# Altium schematic sheet Sheet_1_2022-01-15.schdoc
size 300 x 125 mm
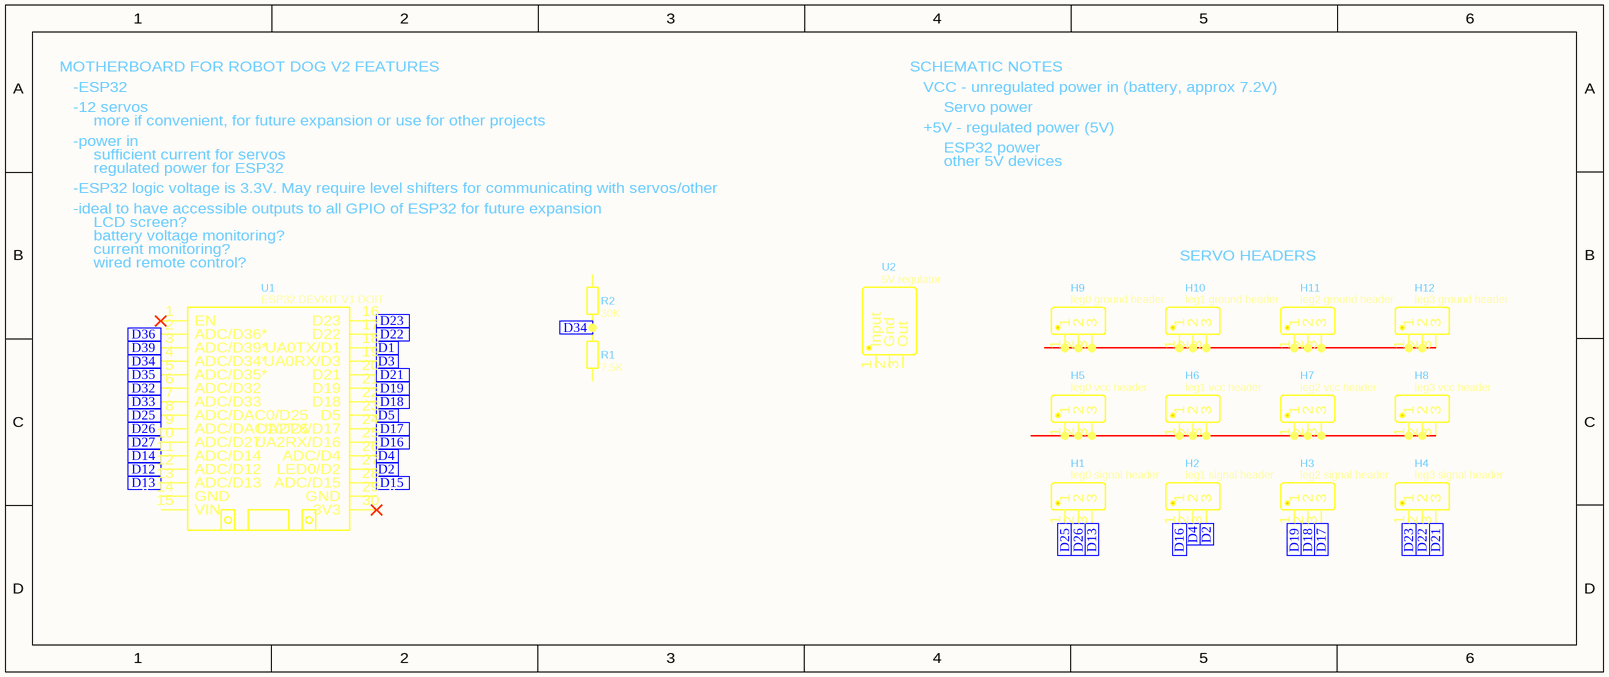
[diagram p0: Sheet_1_2022-01-15.schdoc]

## Parts
H1  leg0 signal header  [HDR-TH_3P-P2.54-V-M]
H2  leg1 signal header  [HDR-TH_3P-P2.54-V-M]
H3  leg2 signal header  [HDR-TH_3P-P2.54-V-M]
H4  leg3 signal header  [HDR-TH_3P-P2.54-V-M]
H5  leg0 vcc header  [HDR-TH_3P-P2.54-V-M]
H6  leg1 vcc header  [HDR-TH_3P-P2.54-V-M]
H7  leg2 vcc header  [HDR-TH_3P-P2.54-V-M]
H8  leg3 vcc header  [HDR-TH_3P-P2.54-V-M]
H9  leg0 ground header  [HDR-TH_3P-P2.54-V-M]
H10  leg1 ground header  [HDR-TH_3P-P2.54-V-M]
H11  leg2 ground header  [HDR-TH_3P-P2.54-V-M]
H12  leg3 ground header  [HDR-TH_3P-P2.54-V-M]
R1  7.5K  [RES-TH_BD2.5-L6.5-P10.50-D0.6]
R2  30K  [RES-TH_BD2.2-L6.5-P10.50-D0.6]
U1  ESP32 DEVKIT V1 DOIT  [DOIT-ESP32-DEVKIT-V1]
U2  5V regulator  [TO-220-3_L10.0-W4.5-P2.54-L]

## Blocks framed on the sheet
SERVO HEADERS: H1-H12

## Ports
D1 (in), D2 (in), D3 (in), D4 (in), D5 (in), D12 (in), D13 (in), D14 (in), D15 (in), D16 (in), D17 (in), D18 (in), D19 (in), D21 (in), D22 (in), D23 (in), D25 (in), D26 (in), D27 (in), D32 (in), D33 (in), D34 (in), D35 (in), D36 (in), D39 (in)

## Nets
+5V: U1.15(VIN) U2.3(Out)
GND: H9.1 H9.2 H9.3 H10.1 H10.2 H10.3 H11.1 H11.2 H11.3 H12.1 H12.2 H12.3 R1.1 U1.14(GND) U1.29(GND) U2.2(Gnd)
VCC: H5.1 H5.2 H5.3 H6.1 H6.2 H6.3 H7.1 H7.2 H7.3 H8.1 H8.2 H8.3 R2.2 U2.1(Input)
D1: U1.18(UA0TX/D1) ; port D1
D2: H2.3 U1.27(LED0/D2) ; port D2
D3: U1.19(UA0RX/D3) ; port D3
D4: H2.2 U1.26(ADC/D4) ; port D4
D5: U1.23(D5) ; port D5
D12: U1.12(ADC/D12) ; port D12
D13: H1.3 U1.13(ADC/D13) ; port D13
D14: U1.11(ADC/D14) ; port D14
D15: U1.28(ADC/D15) ; port D15
D16: H2.1 U1.25(UA2RX/D16) ; port D16
D17: H3.3 U1.24(UA2TX/D17) ; port D17
D18: H3.2 U1.22(D18) ; port D18
D19: H3.1 U1.21(D19) ; port D19
D21: H4.3 U1.20(D21) ; port D21
D22: H4.2 U1.17(D22) ; port D22
D23: H4.1 U1.16(D23) ; port D23
D25: H1.1 U1.8(ADC/DAC0/D25) ; port D25
D26: H1.2 U1.9(ADC/DAC1/D26) ; port D26
D27: U1.10(ADC/D27) ; port D27
D32: U1.6(ADC/D32) ; port D32
D33: U1.7(ADC/D33) ; port D33
D34: R1.2 R2.1 U1.4(ADC/D34*) ; port D34
D35: U1.5(ADC/D35*) ; port D35
D36: U1.2(ADC/D36*) ; port D36
D39: U1.3(ADC/D39*) ; port D39

Not connected (* = marked no-connect by the designer): U1 1(EN)* 30(3V3)*

## Notes on the sheet
- MOTHERBOARD FOR ROBOT DOG V2 FEATURES
- -ESP32
- SCHEMATIC NOTES
- VCC - unregulated power in (battery, approx 7.2V)
- -12 servos
- -power in
- more if convenient, for future expansion or use for other projects
- sufficient current for servos
- +5V - regulated power (5V)
- Servo power
- ESP32 power
- -ESP32 logic voltage is 3.3V. May require level shifters for communicating with servos/other
- -ideal to have accessible outputs to all GPIO of ESP32 for future expansion
- regulated power for ESP32
- LCD screen?
- other 5V devices
- battery voltage monitoring?
- current monitoring?
- (near U1) wired remote control?

## Library data of the parts
H1 = leg0 signal header: BOM_Manufacturer: XKB Connectivity; BOM_Manufacturer Part: X6511WV-03H-C30D60; Contributor: LCSC; BOM_Supplier: LCSC; BOM_Supplier Part: C706875; BOM_JLCPCB Part Class: Extended Part; spicePre: H; spiceSymbolName: X6511WV-03H-C30D60
H2 = leg1 signal header: BOM_Manufacturer: XKB Connectivity; BOM_Manufacturer Part: X6511WV-03H-C30D60; Contributor: LCSC; BOM_Supplier: LCSC; BOM_Supplier Part: C706875; BOM_JLCPCB Part Class: Extended Part; spicePre: H; spiceSymbolName: X6511WV-03H-C30D60
H3 = leg2 signal header: BOM_Manufacturer: XKB Connectivity; BOM_Manufacturer Part: X6511WV-03H-C30D60; Contributor: LCSC; BOM_Supplier: LCSC; BOM_Supplier Part: C706875; BOM_JLCPCB Part Class: Extended Part; spicePre: H; spiceSymbolName: X6511WV-03H-C30D60
H4 = leg3 signal header: BOM_Manufacturer: XKB Connectivity; BOM_Manufacturer Part: X6511WV-03H-C30D60; Contributor: LCSC; BOM_Supplier: LCSC; BOM_Supplier Part: C706875; BOM_JLCPCB Part Class: Extended Part; spicePre: H; spiceSymbolName: X6511WV-03H-C30D60
H5 = leg0 vcc header: BOM_Manufacturer: XKB Connectivity; BOM_Manufacturer Part: X6511WV-03H-C30D60; Contributor: LCSC; BOM_Supplier: LCSC; BOM_Supplier Part: C706875; BOM_JLCPCB Part Class: Extended Part; spicePre: H; spiceSymbolName: X6511WV-03H-C30D60
H6 = leg1 vcc header: BOM_Manufacturer: XKB Connectivity; BOM_Manufacturer Part: X6511WV-03H-C30D60; Contributor: LCSC; BOM_Supplier: LCSC; BOM_Supplier Part: C706875; BOM_JLCPCB Part Class: Extended Part; spicePre: H; spiceSymbolName: X6511WV-03H-C30D60
H7 = leg2 vcc header: BOM_Manufacturer: XKB Connectivity; BOM_Manufacturer Part: X6511WV-03H-C30D60; Contributor: LCSC; BOM_Supplier: LCSC; BOM_Supplier Part: C706875; BOM_JLCPCB Part Class: Extended Part; spicePre: H; spiceSymbolName: X6511WV-03H-C30D60
H8 = leg3 vcc header: BOM_Manufacturer: XKB Connectivity; BOM_Manufacturer Part: X6511WV-03H-C30D60; Contributor: LCSC; BOM_Supplier: LCSC; BOM_Supplier Part: C706875; BOM_JLCPCB Part Class: Extended Part; spicePre: H; spiceSymbolName: X6511WV-03H-C30D60
H9 = leg0 ground header: BOM_Manufacturer: XKB Connectivity; BOM_Manufacturer Part: X6511WV-03H-C30D60; Contributor: LCSC; BOM_Supplier: LCSC; BOM_Supplier Part: C706875; BOM_JLCPCB Part Class: Extended Part; spicePre: H; spiceSymbolName: X6511WV-03H-C30D60
H10 = leg1 ground header: BOM_Manufacturer: XKB Connectivity; BOM_Manufacturer Part: X6511WV-03H-C30D60; Contributor: LCSC; BOM_Supplier: LCSC; BOM_Supplier Part: C706875; BOM_JLCPCB Part Class: Extended Part; spicePre: H; spiceSymbolName: X6511WV-03H-C30D60
H11 = leg2 ground header: BOM_Manufacturer: XKB Connectivity; BOM_Manufacturer Part: X6511WV-03H-C30D60; Contributor: LCSC; BOM_Supplier: LCSC; BOM_Supplier Part: C706875; BOM_JLCPCB Part Class: Extended Part; spicePre: H; spiceSymbolName: X6511WV-03H-C30D60
H12 = leg3 ground header: BOM_Manufacturer: XKB Connectivity; BOM_Manufacturer Part: X6511WV-03H-C30D60; Contributor: LCSC; BOM_Supplier: LCSC; BOM_Supplier Part: C706875; BOM_JLCPCB Part Class: Extended Part; spicePre: H; spiceSymbolName: X6511WV-03H-C30D60
R1 = 7.5K: BOM_Manufacturer: UniOhm; BOM_Manufacturer Part: MFR0W4F7501A50; nameAlias: Resistance (Ohms); BOM_Supplier: LCSC; BOM_Supplier Part: C58628; BOM_JLCPCB Part Class: Extended Part; spicePre: R; spiceSymbolName: MFR0W4F7501A50
R2 = 30K: BOM_Manufacturer: UniOhm; BOM_Manufacturer Part: MFR0W4F3002A50; nameAlias: Resistance (Ohms); BOM_Supplier: LCSC; BOM_Supplier Part: C58652; BOM_JLCPCB Part Class: Extended Part; spicePre: R; spiceSymbolName: MFR0W4F3002A50
U1 = ESP32 DEVKIT V1 DOIT: Contributor: ConceitoTeam; spicePre: U; spiceSymbolName: ESP32 DEVKIT V1 DOIT
U2 = 5V regulator: BOM_Manufacturer: Youtai Semiconductor Co., Ltd.; BOM_Manufacturer Part: L7805CV; Contributor: LCSC; BOM_Supplier: LCSC; BOM_Supplier Part: C347289; BOM_JLCPCB Part Class: Extended Part; spicePre: U; spiceSymbolName: L7805CV_C347289